# Altium schematic sheet GPIO_EXPANDER_A.SchDoc
size A; SheetNumber: 8; SheetTotal: 12
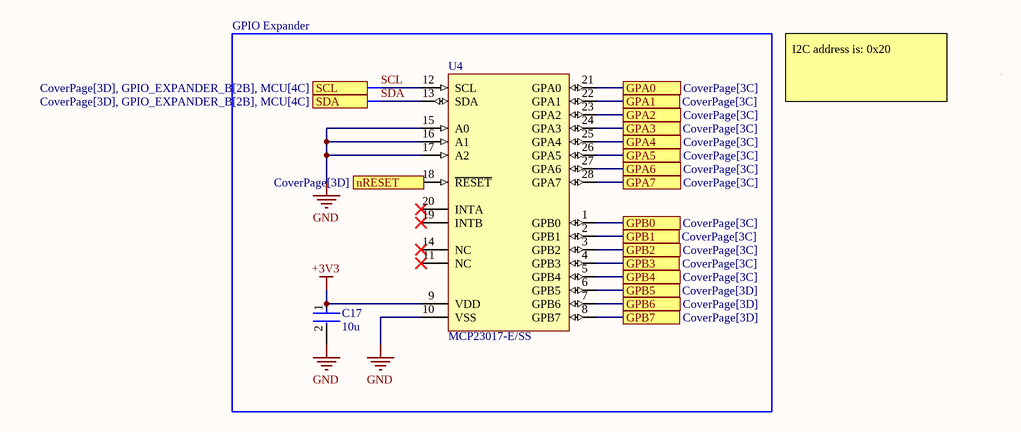
[diagram p0: GPIO_EXPANDER_A.SchDoc]

## Parts
C17  10u  [FP-C0805C-DG-MFG]
U4  MCP23017-E/SS  [SSOP-SS28_N]

## Ports
GPA0 (see CoverPage[3C]), GPA1 (see CoverPage[3C]), GPA2 (see CoverPage[3C]), GPA3 (see CoverPage[3C]), GPA4 (see CoverPage[3C]), GPA5 (see CoverPage[3C]), GPA6 (see CoverPage[3C]), GPA7 (see CoverPage[3C]), GPB0 (see CoverPage[3C]), GPB1 (see CoverPage[3C]), GPB2 (see CoverPage[3C]), GPB3 (see CoverPage[3C]), GPB4 (see CoverPage[3C]), GPB5 (see CoverPage[3D]), GPB6 (see CoverPage[3D]), GPB7 (see CoverPage[3D]), nRESET (in, see CoverPage[3D]), SCL (see CoverPage[3D], GPIO_EXPANDER_B[2B], MCU[4C]), SDA (see CoverPage[3D], GPIO_EXPANDER_B[2B], MCU[4C])

## Nets
+3V3: C17.1 U4.9(VDD)
GND: C17.2 U4.10(VSS) U4.15(A0) U4.16(A1) U4.17(A2)
GPA0: U4.21(GPA0) ; port GPA0
GPA1: U4.22(GPA1) ; port GPA1
GPA2: U4.23(GPA2) ; port GPA2
GPA3: U4.24(GPA3) ; port GPA3
GPA4: U4.25(GPA4) ; port GPA4
GPA5: U4.26(GPA5) ; port GPA5
GPA6: U4.27(GPA6) ; port GPA6
GPA7: U4.28(GPA7) ; port GPA7
GPB0: U4.1(GPB0) ; port GPB0
GPB1: U4.2(GPB1) ; port GPB1
GPB2: U4.3(GPB2) ; port GPB2
GPB3: U4.4(GPB3) ; port GPB3
GPB4: U4.5(GPB4) ; port GPB4
GPB5: U4.6(GPB5) ; port GPB5
GPB6: U4.7(GPB6) ; port GPB6
GPB7: U4.8(GPB7) ; port GPB7
SCL: U4.12(SCL) ; port SCL
SDA: U4.13(SDA) ; port SDA

Not connected (* = marked no-connect by the designer): U4 11(NC)* 14(NC)* 18(~{RESET}) 19(INTB)* 20(INTA)*

## Notes on the sheet
- GPIO Expander
- I2C address is: 0x20
- Type @ to refer to a designator or a net

## Library data of the parts
C17 = CMP-2007-03243-2: CAP CER 10UF 10V X5R 0805; Manufacturer Part Number: C0805C106K8PACTU; Manufacturer: Kemet; 3DS Part Number: 220-00001; Tolerance: 10%; Temperature Coefficient: 15%; Material: Ceramic; Device Class L2: Capacitors; Device Class L1: Passive Components; ComponentLink2URL: https://content.kemet.com/datasheets/KEM_C1006_X5R_SMD.pdf; Height: 1.4mm; Lead Free: Yes; Digikey Description: CAP CER 10UF 10V X5R 0805; Octopart: https://octopart.com/c0805c106k8pactu-kemet-98697; Capacitance: 10uF; Value: 10uF; Temperature Range Low: -55°C; Temperature: -55°C to +85°C; Automotive: No; Mouser Description: CAP CER 10UF 10V X5R 0805; Ipc Land Pattern Name: CAPC200125X125; Temperature Range High: +85°C; Voltage: 10V; RoHS: TRUE; Device Class L3: Ceramic Capacitors; ComponentLink2Description: Datasheet; Voltage Rating: 10V; Package: C0805C-DG; Temperature Characteristic: X5R; Category: Cap
U4 = CMP-0186-00176-2: 16-Bit I/O Expander with Serial Interface, 28-Pin SSOP, Extended Temperature; PackageVersion: revBB, Aug-2009; ComponentLink1Description: Manufacturer URL; ComponentLink3Description: Package Specification; PackageDescription: 28-Lead Plastic Shrink Small Outline (SS) - 5.3mm Body [SSOP]; ComponentLink1URL: http://www.microchip.com/; Code_JEDEC: MS-150; RevisionNote: URLs added.; ComponentLink3URL: http://www.microchip.com/stellent/groups/techpub_sg/documents/packagingspec/en012702.pdf; ComponentLink2URL: http://ww1.microchip.com/downloads/en/DeviceDoc/21952b.pdf; ComponentLink2Description: Datasheet; PackageReference: SSOP-SS28; DatasheetVersion: revB, Feb-2007